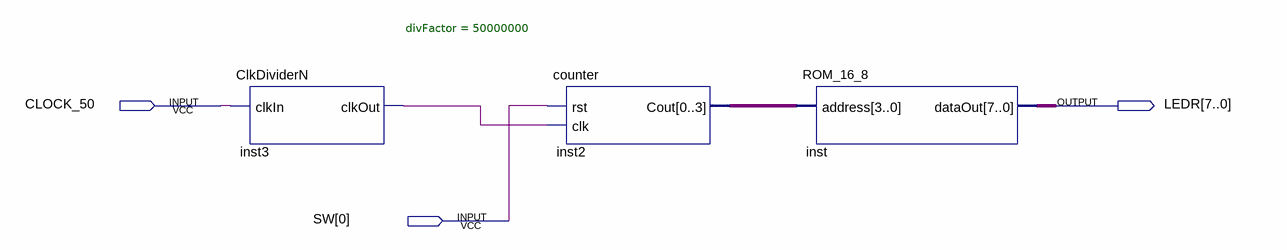
[diagram p0: schematic sheet]
// Quartus schematic ROM_Demo.bdf as structural Verilog: 3 symbols, 3 pins
module ROM_Demo (
  input  CLOCK_50,
  input  [0:0] SW,
  output [7:0] LEDR
);

  wire inst3_clkout;
  wire [3:0] inst2_cout;

  ClkDividerN #(.divFactor(50000000)) inst3 (.clkIn(CLOCK_50), .clkOut(inst3_clkout));
  counter inst2 (.rst(SW[0]), .clk(inst3_clkout), .Cout(inst2_cout));
  ROM_16_8 inst (.address(inst2_cout), .dataOut(LEDR));
endmodule
